# EAGLE design main (EAGLE 7.7.0)
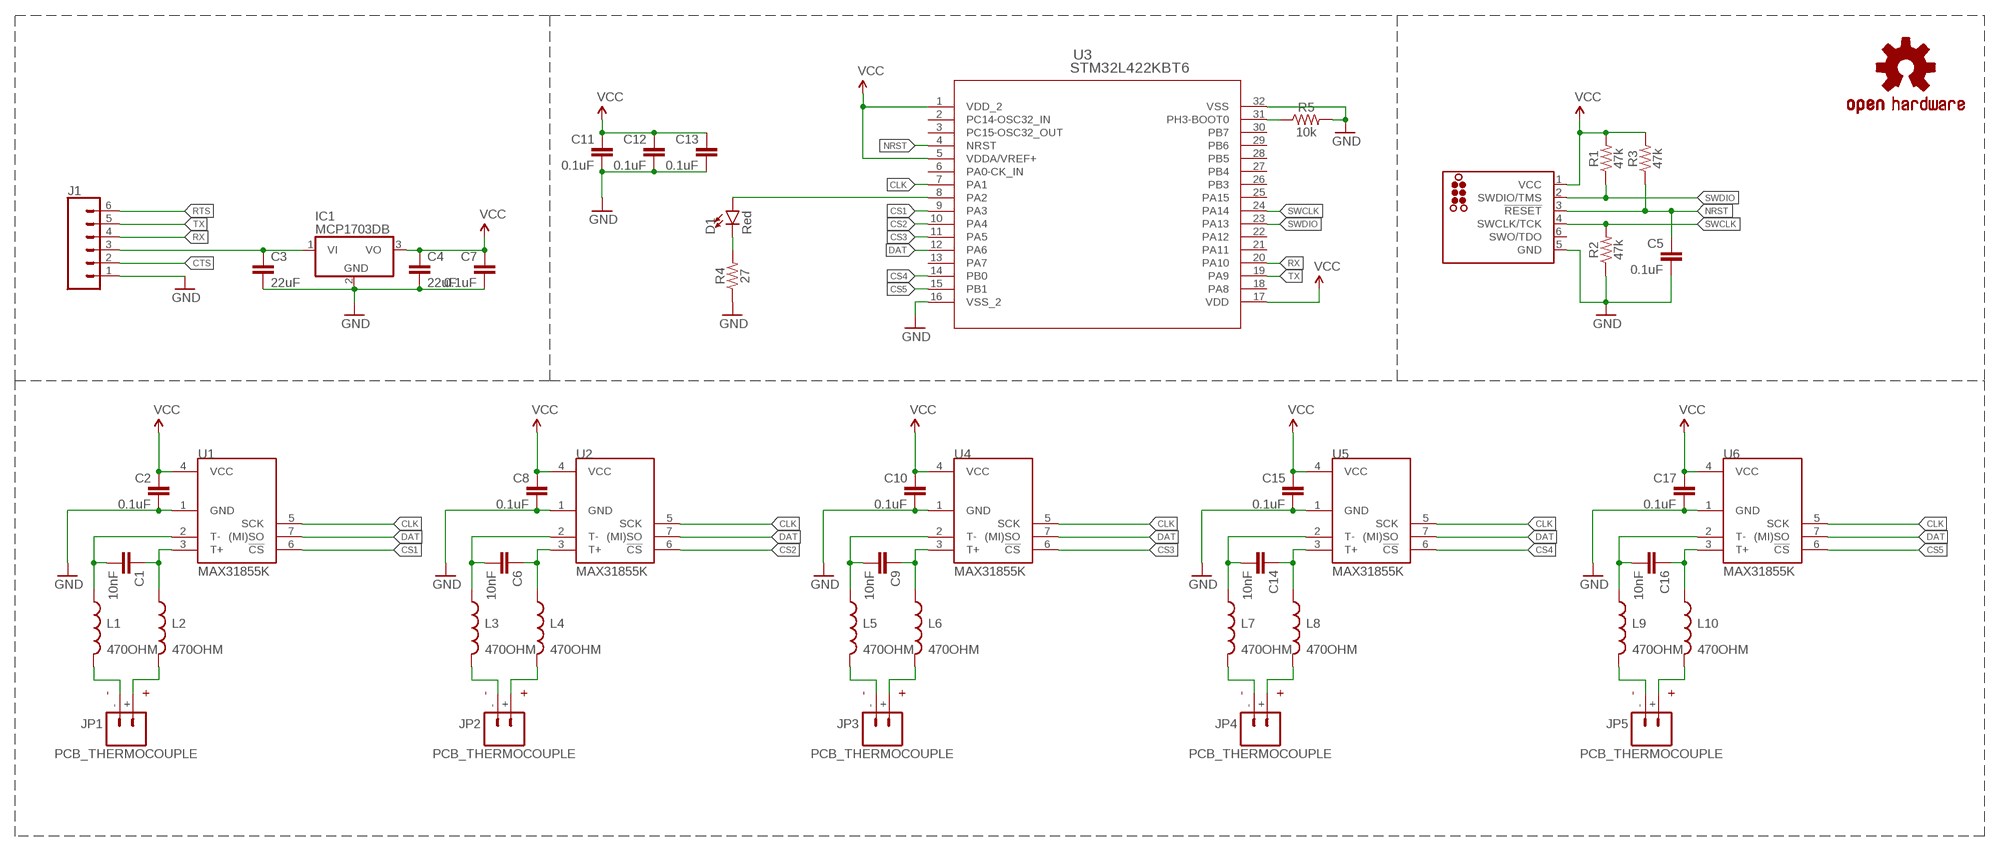
[diagram p0: schematic, sheet 1]

## Parts
C1  10nF  10NF/10000PF-50V-10%(0603)  [0603-CAP]
C2  0.1uF  0.1UF-25V(+80/-20%)(0603)  [0603-CAP]
C3  22uF  22UF-0603-6.3V-20%  [0603]
C4  22uF  22UF-0603-6.3V-20%  [0603]
C5  0.1uF  0.1UF-25V(+80/-20%)(0603)  [0603-CAP]
C6  10nF  10NF/10000PF-50V-10%(0603)  [0603-CAP]
C7  0.1uF  0.1UF-25V(+80/-20%)(0603)  [0603-CAP]
C8  0.1uF  0.1UF-25V(+80/-20%)(0603)  [0603-CAP]
C9  10nF  10NF/10000PF-50V-10%(0603)  [0603-CAP]
C10  0.1uF  0.1UF-25V(+80/-20%)(0603)  [0603-CAP]
C11  0.1uF  0.1UF-25V(+80/-20%)(0603)  [0603-CAP]
C12  0.1uF  0.1UF-25V(+80/-20%)(0603)  [0603-CAP]
C13  0.1uF  0.1UF-25V(+80/-20%)(0603)  [0603-CAP]
C14  10nF  10NF/10000PF-50V-10%(0603)  [0603-CAP]
C15  0.1uF  0.1UF-25V(+80/-20%)(0603)  [0603-CAP]
C16  10nF  10NF/10000PF-50V-10%(0603)  [0603-CAP]
C17  0.1uF  0.1UF-25V(+80/-20%)(0603)  [0603-CAP]
D1  Red  LED-RED-0603-WE  [LED-0603]
IC1  MCP1703DB  [SOT223]
J1  CONN_06NO_SILK_NO_POP  [1X06_NO_SILK]
J2  TC2030_SWD-MCP-NL  [TC2030-MCP-NL]
JP1  PCB_THERMOCOUPLE  [PCC-SMP]
JP2  PCB_THERMOCOUPLE  [PCC-SMP]
JP3  PCB_THERMOCOUPLE  [PCC-SMP]
JP4  PCB_THERMOCOUPLE  [PCC-SMP]
JP5  PCB_THERMOCOUPLE  [PCC-SMP]
L1  470OHM  INDUCTOR0603  [0603]
L2  470OHM  INDUCTOR0603  [0603]
L3  470OHM  INDUCTOR0603  [0603]
L4  470OHM  INDUCTOR0603  [0603]
L5  470OHM  INDUCTOR0603  [0603]
L6  470OHM  INDUCTOR0603  [0603]
L7  470OHM  INDUCTOR0603  [0603]
L8  470OHM  INDUCTOR0603  [0603]
L9  470OHM  INDUCTOR0603  [0603]
L10  470OHM  INDUCTOR0603  [0603]
LOGO1  OSHW-LOGOL  [OSHW-LOGO-L]
R1  47k  47KOHM-0603-1/10W-1%  [0603]
R2  47k  47KOHM-0603-1/10W-1%  [0603]
R3  47k  47KOHM-0603-1/10W-1%  [0603]
R4  27  27OHM-0603-1/10W-1%  [0603]
R5  10k  10KOHM-0603-1/10W-1%  [0603]
U1  MAX31855K  [SOIC8]
U2  MAX31855K  [SOIC8]
U3  STM32L422KBT6  [LQFP_422KBT6_STM]
U4  MAX31855K  [SOIC8]
U5  MAX31855K  [SOIC8]
U6  MAX31855K  [SOIC8]

## Nets
+5V: C3.1 IC1.1(VI) J1.3
CLK: U1.5(SCK) U2.5(SCK) U3.7(PA1) U4.5(SCK) U5.5(SCK) U6.5(SCK)
CS1: U1.6(!CS) U3.9(PA3)
CS2: U2.6(!CS) U3.10(PA4)
CS3: U3.11(PA5) U4.6(!CS)
CS4: U3.14(PB0) U5.6(!CS)
CS5: U3.15(PB1) U6.6(!CS)
CTS: J1.2
DAT: U1.7((MI)SO) U2.7((MI)SO) U3.12(PA6) U4.7((MI)SO) U5.7((MI)SO) U6.7((MI)SO)
GND: C2.2 C3.2 C4.2 C5.2 C7.2 C8.2 C10.2 C11.2 C12.2 C13.2 C15.2 C17.2 IC1.2(GND) J1.1 J2.5(GND) R2.1 R4.1 R5.2 U1.1(GND) U2.1(GND) U3.16(VSS_2) U3.32(VSS) U4.1(GND) U5.1(GND) U6.1(GND)
N$1: C6.1 L4.1 U2.3(T+)
N$2: C6.2 L3.1 U2.2(T-)
N$3: JP2.- L3.2
N$4: JP2.+ L4.2
N$5: C1.2 L1.1 U1.2(T-)
N$6: JP1.- L1.2
N$7: C1.1 L2.1 U1.3(T+)
N$8: C9.1 L6.1 U4.3(T+)
N$9: JP1.+ L2.2
N$10: C9.2 L5.1 U4.2(T-)
N$11: JP3.- L5.2
N$12: JP3.+ L6.2
N$13: C14.1 L8.1 U5.3(T+)
N$14: C14.2 L7.1 U5.2(T-)
N$15: JP4.- L7.2
N$16: JP4.+ L8.2
N$17: C16.1 L10.1 U6.3(T+)
N$18: C16.2 L9.1 U6.2(T-)
N$19: JP5.- L9.2
N$20: JP5.+ L10.2
N$21: D1.A U3.8(PA2)
N$22: D1.C R4.2
N$23: R5.1 U3.31(PH3-BOOT0)
NRST: C5.1 J2.3(!RESET) R3.1 U3.4(NRST)
RTS: J1.6
RX: J1.4 U3.20(PA10)
SWCLK: J2.4(SWCLK/TCK) R2.2 U3.24(PA14)
SWDIO: J2.2(SWDIO/TMS) R1.1 U3.23(PA13)
TX: J1.5 U3.19(PA9)
VCC: C2.1 C4.1 C7.1 C8.1 C10.1 C11.1 C12.1 C13.1 C15.1 C17.1 IC1.3(VO) J2.1(VCC) R1.2 R3.2 U1.4(VCC) U2.4(VCC) U3.1(VDD_2) U3.5(VDDA/VREF+) U3.17(VDD) U4.4(VCC) U5.4(VCC) U6.4(VCC)
Unconnected: J2.6(SWO/TDO) JP1.CLIP1 JP1.CLIP2 JP2.CLIP1 JP2.CLIP2 JP3.CLIP1 JP3.CLIP2 JP4.CLIP1 JP4.CLIP2 JP5.CLIP1 JP5.CLIP2 U3.2(PC14-OSC32_IN) U3.3(PC15-OSC32_OUT) U3.6(PA0-CK_IN) U3.13(PA7) U3.18(PA8) U3.21(PA11) U3.22(PA12) U3.25(PA15) U3.26(PB3) U3.27(PB4) U3.28(PB5) U3.29(PB6) U3.30(PB7)

## Library data of the parts
C1 C6 C9 C14 C16 = SparkFun-Capacitors:10NF/10000PF-50V-10%(0603): CAP-00867; PROD_ID: CAP-00867
C2 C5 C7 C8 C10-C13 C15 C17 = SparkFun-Capacitors:0.1UF-25V(+80/-20%)(0603): CAP-00810 Ceramic Standard decoupling cap; PROD_ID: CAP-00810
C3 C4 = SparkFun-Capacitors:22UF: 22µF ceramic capacitors A capacitor is a passive two-terminal electrical component used to store electrical energy temporarily in an electric field.; PROD_ID: CAP-14464
D1 = SparkFun-LED:LED-RED: Red SMD LED Used in manufacturing of most products at SparkFun Packages: 0603 - SMD 0603 package [Product Link] <http://docs.avagotech.com/docs/AV02-0551EN> 0603 SMART - SMD 0603 SMART package ( more efficient and expensive)[Product Link] <http://www.osram-os.com/Graphics/XPic2/00077099_0.pdf> 1206 - SMD1206 package [Product Link] <https://www.sparkfun.com/datasheets/DevTools/LilyPad/Q150OVS4.pdff> SparkFun Products: Pro Mini 328 -5V <https://www.sparkfun.com/products/821> RedBoard <https://www.sparkfun.com/products/12757> IOIO-OTG <https://www.sparkfun.com/products/13613>; PROD_ID: DIO-16511
IC1 = linear:MCP1703: 250 mA, 16V, Low Quiescent Current LDO Regulator Source: http://ww1.microchip.com/downloads/en/DeviceDoc/22049b.pdf
J1 = SparkFun-Connectors:CONN_06: Multi connection point. Often used as Generic Header-pin footprint for 0.1 inch spaced/style header connections On any of the 0.1 inch spaced packages, you can populate with these: Break Away Headers - Straight <https://www.sparkfun.com/products/116> (PRT-00116) Break Away Male Headers - Right Angle <https://www.sparkfun.com/products/553> (PRT-00553) Female Headers <https://www.sparkfun.com/products/115> (PRT-00115) Break Away Headers - Machine Pin <https://www.sparkfun.com/products/117> (PRT-00117) Break Away Female Headers - Swiss Machine Pin <https://www.sparkfun.com/products/743> (PRT-00743) Arduino Stackable Header - 6 Pin <https://www.sparkfun.com/products/9280> (PRT-09280) Screw Terminals 2.54mm Pitch (6-Pin) <https://www.sparkfun.com/products/16499> (PRT-16499) For SCREWTERMINALS and SPRING TERMINALS visit here: Screw Terimnals on SparkFun.com <https://www.sparkfun.com/search/results?term=Screw+Terminals> (5mm/3.5mm/2.54mm spacing) This device is also useful as a general connection point to wire up your design to another part of your project. Our various solder wires solder well into these plated through hole pads. Hook-Up Wire - Assortment (Stranded, 22 AWG) <https://www.sparkfun.com/products/11375> (PRT-11375) Hook-Up Wire - Assortment (Solid Core, 22 AWG) <https://www.sparkfun.com/products/11367> (PRT-11367) View the entire wire category on our website here <https://www.sparkfun.com/categories/141>
J2 = tag-connect:TC2030_SWD: ARM20-CTX 20-Pin to TC2030-IDC Adapter for Cortex 6-Pin (TC2030-IDC family) </catalog/6> Cortex SWD </catalog/9> Adapters </adaptors> <javascript:void(0);> The Tag-Connect ARM20-CTX adapter board allows our TC2030-IDC cables to be used for ARM SWD (Single Wire Debug) applications. Although intended for use with our patented TC2030-IDC (and TC2030-IDC-NL) Plug-of-Nails™ Cables, the adapter may be useful to people wishing to use 6-pin 0.1” ribbon headers on their PCB instead of the traditional 20-Pin header. Please note the TC2030-IDC <http://tag-connect.com/TC2030-IDC> or TC2030-IDC-NL <http://tag-connect.com/TC2030-IDC-NL> cable is purchased separately, the cables and Segger JLINK seen in the pictures are not included! Download the Datasheet here. <http://www.tag-connect.com/Materials/ARM20-CTX.pdf>
JP1-JP5 = Testing:PCB_THERMOCOUPLE: Circuit Board Thermocouple Connectors Glass-Filled Nylon 220°C (425°F) The PCC connector from OMEGA is perfect for bringing thermocouple probes to printed circuit boards. (OMEGA PCC-SMP) For type-k thermocouples.
L1-L10 = SparkFun-Passives:INDUCTOR: Inductors Basic Inductor/Choke - 0603 and 1206. Footprints are not proven and vary greatly between part numbers. INDUCTOR POWER 3.3UH 4.0A SMD 0.197" L x 0.197" W x 0.177" H (5.00mm x 5.00mm x 4.50mm); PROD_ID: NDUC-12579
LOGO1 = SparkFun-Aesthetics:OSHW-LOGO: Open-Source Hardware (OSHW) Logo This logo indicates the piece of hardware it is found on incorporates a OSHW license and/or adheres to the definition of open source hardware found here: http://freedomdefined.org/OSHW
R1-R3 = SparkFun-Resistors:47KOHM: 47kΩ resistor A resistor is a passive two-terminal electrical component that implements electrical resistance as a circuit element. Resistors act to reduce current flow, and, at the same time, act to lower voltage levels within circuits. - Wikipedia; PROD_ID: RES-07871
R4 = SparkFun-Resistors:27OHM: 27Ω resistor A resistor is a passive two-terminal electrical component that implements electrical resistance as a circuit element. Resistors act to reduce current flow, and, at the same time, act to lower voltage levels within circuits. - Wikipedia; PROD_ID: RES-09334
R5 = SparkFun-Resistors:10KOHM: 10kΩ resistor A resistor is a passive two-terminal electrical component that implements electrical resistance as a circuit element. Resistors act to reduce current flow, and, at the same time, act to lower voltage levels within circuits. - Wikipedia; PROD_ID: RES-00824
U1 U2 U4-U6 = SparkFun-AnalogIC:MAX31855K: Cold-Junction-Compensated K-Thermocoupleto-Digital Converter (-270°C to +1800°C) The MAX31855K performs cold-junction compensation and digitizes the signal from a type-K thermocouple. The data is output in a 14-bit resolution, SPI™-compatible, read-only format. This converter resolves temperatures to 0.25°C, allows readings as high as +1800°C and as low as -270°C, and exhibits thermocouple accuracy of ±2°C for temperatures ranging from -200°C to +700°C for K-type thermocouples.; PROD_ID: IC-12578
U3 = stm32xx:STM32L422KBT6; COPYRIGHT: Copyright (C) 2023 Ultra Librarian. All rights reserved.; MANUFACTURER_PART_NUMBER: STM32L422KBT6; MFR_NAME: STMicroelectronics

## Board
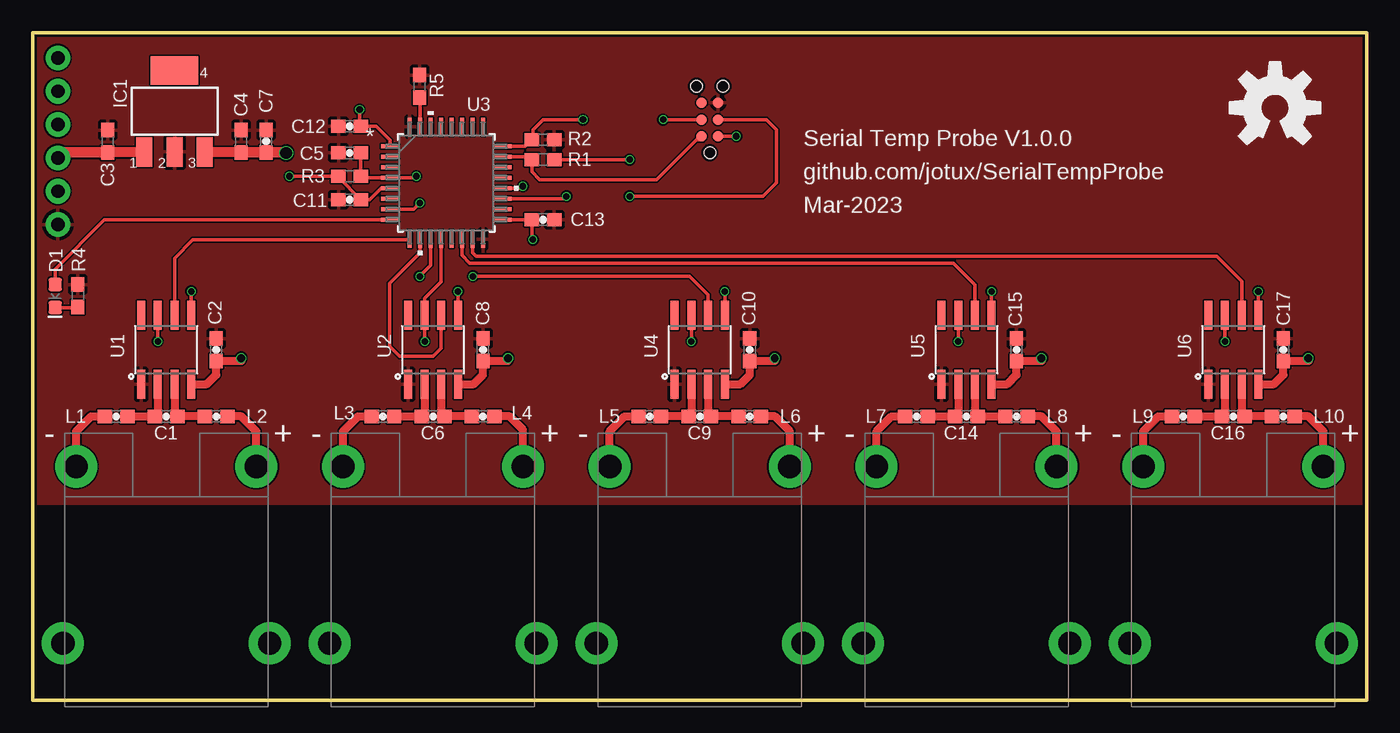
[diagram p1: board, top side]
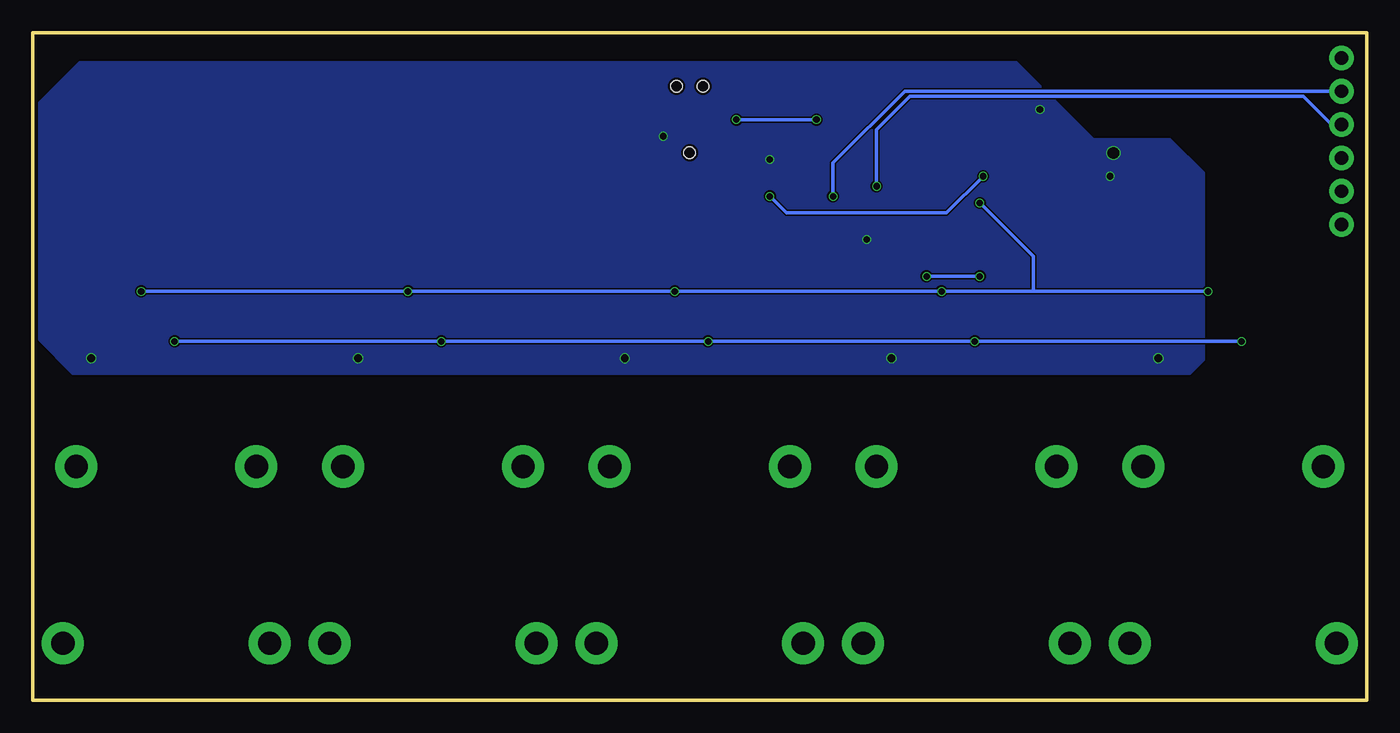
[diagram p2: board, bottom side, seen from below]

Size 101.6 x 50.8 mm. Coordinates in mm from the lower left corner, seen from the top.
Outline: 0,0 101.6,0 101.6,50.8 0,50.8 0,0
Copper layers (1*16): Top 0.035mm / dielectric 1.6mm / Bottom 0.035mm
Design rules "jlcpcb-2layers": minimum track width 5mil, minimum drill 0.3mm, track to track 5mil, track to pad 5mil, pad to pad 5mil, via to via 5mil, smd to smd 5mil, copper to edge 0.2mm, drill to drill 6mil, minimum pad ring 10mil, minimum via ring 3mil, stop-mask expansion 4mil, vias tented up to drill 0mil, thermal gap 10mil

### Footprints (pad centres in the part's own frame; a part is rotated, then mirrored left to right if it is on the bottom)
0603-CAP = smd 1.1 x 1: 1 -0.85,0; 2 0.85,0
0603 = smd 1.1 x 1: 1 -0.85,0; 2 0.85,0
LED-0603 = smd 1 x 1: A -0.877,0; C 0.877,0
SOT223 = smd 1.219 x 2.235: 1 -2.311,-3.099; 2 0,-3.099; 3 2.311,-3.099 | smd 3.6 x 2.2: 4 0,3.099
1X06_NO_SILK = drill 1.016 pad 1.88: 1 0,0; 2 2.54,0; 3 5.08,0; 4 7.62,0; 5 10.16,0; 6 12.7,0
TC2030-MCP-NL = smd 0.787 x 0.787: 1 1.27,-0.635; 2 1.27,0.635; 3 2.54,-0.635; 4 2.54,0.635; 5 3.81,-0.635; 6 3.81,0.635 | hole 0.889: 0,0; 5.08,-1.016; 5.08,1.016
PCC-SMP = drill 1.778: + 6.858,0; - -6.858,0; CLIP1 -7.874,-13.462; CLIP2 7.874,-13.462
SOIC8 = smd 0.61 x 2.21: 1 -1.905,-2.616; 2 -0.635,-2.616; 3 0.635,-2.616; 4 1.905,-2.616; 5 1.905,2.616; 6 0.635,2.616; 7 -0.635,2.616; 8 -1.905,2.616
LQFP_422KBT6_STM = smd 1.359 x 0.305: 1 -4.274,2.8; 2 -4.274,2; 3 -4.274,1.2; 4 -4.274,0.4; 5 -4.274,-0.4; 6 -4.274,-1.2; 7 -4.274,-2; 8 -4.274,-2.8; 17 4.274,-2.8; 18 4.274,-2; 19 4.274,-1.2; 20 4.274,-0.4; 21 4.274,0.4; 22 4.274,1.2; 23 4.274,2; 24 4.274,2.8 | smd 0.305 x 1.359: 9 -2.8,-4.274; 10 -2,-4.274; 11 -1.2,-4.274; 12 -0.4,-4.274; 13 0.4,-4.274; 14 1.2,-4.274; 15 2,-4.274; 16 2.8,-4.274; 25 2.8,4.274; 26 2,4.274; 27 1.2,4.274; 28 0.4,4.274; 29 -0.4,4.274; 30 -1.2,4.274; 31 -2,4.274; 32 -2.8,4.274

### Placement (x,y rotation side)
C1  10.16,21.59 180 top
C2  13.97,26.67 90 top
C3  5.71,42.55 90 top
C4  15.88,42.55 90 top
C5  24.13,41.66 180 top
C6  30.48,21.59 180 top
C7  17.78,42.55 90 top
C8  34.29,26.67 90 top
C9  50.8,21.59 180 top
C10  54.61,26.67 90 top
C11  24.13,38.1 180 top
C12  24.13,43.69 180 top
C13  38.86,36.58 0 top
C14  71.12,21.59 180 top
C15  74.93,26.67 90 top
C16  91.44,21.59 180 top
C17  95.25,26.67 90 top
D1  1.7,30.76 270 top
IC1  10.79,44.83 0 top
J1  1.91,36.2 90 top
J2  51.56,41.66 90 top
JP1  10.16,17.78 0 top
JP2  30.48,17.78 0 top
JP3  50.8,17.78 0 top
JP4  71.12,17.78 0 top
JP5  91.44,17.78 0 top
L1  6.35,21.59 180 top
L2  13.97,21.59 0 top
L3  26.67,21.59 180 top
L4  34.29,21.59 0 top
L5  46.99,21.59 180 top
L6  54.61,21.59 0 top
L7  67.31,21.59 180 top
L8  74.93,21.59 0 top
L9  87.63,21.59 180 top
L10  95.25,21.59 0 top
LOGO1  94.61,45.09 0 top
R1  38.86,41.15 0 top
R2  38.86,42.67 180 top
R3  24.13,39.88 180 top
R4  3.43,30.78 270 top
R5  29.46,46.74 90 top
U1  10.16,26.67 0 top
U2  30.48,26.67 0 top
U3  31.5,39.37 0 top
U4  50.8,26.67 0 top
U5  71.12,26.67 0 top
U6  91.44,26.67 0 top

### Tracks (layer width: path | path; a pad name or v marks a point on that pad's centre or on a via)
+5V
  Top 0.813: J1.3 2.33,41.7 C3.1 IC1.1
CLK  (via drill 0.5)
  Top 0.254: U6.5 v93.34,31.11 | v73.03,31.11 U5.5 | U1.5 v12.06,31.11 | v32.38,31.11 U2.5 | U4.5 v52.7,31.11 | U3.7 28.99,37.37 v29.46,37.85
  Bottom 0.254: v93.34,31.11 v73.03,31.11 v52.7,31.11 v32.38,31.11 25.4,31.11 | v12.06,31.11 25.4,31.11 | v29.46,37.85 25.4,33.78 25.4,31.11
CS1
  Top 0.254: U1.6 10.79,33.66 12.19,35.05 28.65,35.05 U3.9
CS2
  Top 0.254: U2.6 31.11,26.8 30.48,26.16 27.94,26.16 27.18,26.92 27.18,31.75 29.5,34.07 U3.10 29.46,35.06
CS3  (via drill 0.5)
  Top 0.254: v33.53,32.26 50.04,32.26 51.44,30.86 U4.6 | U3.11 30.3,33.09 v29.46,32.26
  Bottom 0.254: v29.46,32.26 v33.53,32.26
CS4
  Top 0.254: U3.14 32.7,33.85 33.27,33.27 70.1,33.27 71.75,31.62 U5.6
CS5
  Top 0.254: U3.15 33.5,34.07 33.78,33.78 90.17,33.78 92.08,31.88 U6.6
DAT  (via drill 0.5)
  Top 0.254: U1.7 v9.53,27.3 | v29.84,27.3 U2.7 29.84,30.61 31.1,31.86 U3.12 | U4.7 v50.16,27.3 | U5.7 v70.48,27.3 | U6.7 v90.81,27.3
  Bottom 0.254: v9.53,27.3 v29.84,27.3 v50.16,27.3 v70.48,27.3 v90.81,27.3
GND
  pour Top: 0.25,50.55 101.35,50.55 101.35,14.99 0.25,14.99
N$1
  Top 0.61: U2.3 31.11,21.8 C6.1 L4.1
N$2
  Top 0.61: L3.1 C6.2 29.84,21.8 U2.2
N$3
  Top 0.61: JP2.- 23.62,20.45 24.77,21.59 L3.2
N$4
  Top 0.61: JP2.+ 37.34,20.57 36.32,21.59 L4.2
N$5
  Top 0.61: L1.1 C1.2 9.53,21.8 U1.2
N$6
  Top 0.61: JP1.- 3.3,20.45 4.45,21.59 L1.2
N$7
  Top 0.61: L2.1 C1.1 10.79,21.8 U1.3
N$8
  Top 0.61: L6.1 C9.1 51.44,21.8 U4.3
N$9
  Top 0.61: JP1.+ 17.02,20.45 15.88,21.59 L2.2
N$10
  Top 0.61: U4.2 50.16,21.8 C9.2 L5.1
N$11
  Top 0.61: JP3.- 43.94,20.45 45.09,21.59 L5.2
N$12
  Top 0.61: JP3.+ 57.66,20.45 56.52,21.59 L6.2
N$13
  Top 0.61: U5.3 71.75,21.8 C14.1 L8.1
N$14
  Top 0.61: L7.1 C14.2 70.48,21.8 U5.2
N$15
  Top 0.61: JP4.- 64.26,20.45 65.41,21.59 L7.2
N$16
  Top 0.61: JP4.+ 77.98,20.45 76.83,21.59 L8.2
N$17
  Top 0.61: U6.3 92.08,21.8 C16.1 L10.1
N$18
  Top 0.61: L9.1 C16.2 90.81,21.8 U6.2
N$19
  Top 0.61: JP5.- 84.58,20.45 85.72,21.59 L9.2
N$20
  Top 0.61: JP5.+ 98.3,20.45 97.16,21.59 L10.2
N$21
  Top 0.254: D1.A 1.7,32.82 5.46,36.57 U3.8
N$22
  Top 0.254: D1.C 3.38,29.88 R4.2
N$23
  Top 0.254: U3.31 29.5,45.85 R5.1
NRST  (via drill 0.5)
  Top 0.254: C5.1 R3.1 25.09,39.77 U3.4 29.1,39.77 v29.21,39.88 | v45.47,38.35 55.63,38.35 56.64,39.37 56.64,43.43 55.88,44.2 J2.3
  Bottom 0.254: v45.47,38.35 44.2,37.08 32,37.08 v29.21,39.88
RX  (via drill 0.5)
  Top 0.254: v37.34,39.12 37.19,38.97 U3.20
  Bottom 0.254: J1.4 2.67,43.81 4.83,45.97 34.8,45.97 37.34,43.43 v37.34,39.12
SWCLK  (via drill 0.5)
  Top 0.254: U3.24 37.51,42.17 R2.2 38.1,42.67 38.1,43.43 38.86,44.2 v41.91,44.2 | v48.01,44.2 J2.4
  Bottom 0.254: v41.91,44.2 v48.01,44.2
SWDIO
  Top 0.254: U3.23 37.79,41.37 R1.1 | 38.1,41.15 R1.1 | J2.2 51.05,42.93 51.05,42.67 50.55,42.67 47.5,39.62 38.61,39.62 38.01,40.22 R1.1
TX  (via drill 0.5)
  Top 0.254: v40.64,38.35 40.46,38.17 U3.19
  Bottom 0.254: J1.5 35.18,46.35 40.64,40.89 v40.64,38.35
VCC  (via drill 0.5, 0.6, 0.9)
  Top 0.254: U3.5 26.52,38.97 25.65,38.1 C11.1 23.28,39.8 R3.2 v19.56,39.88 | U3.1 27.22,42.63 26.16,43.69 C12.1 24.89,43.78 v24.89,44.96 | U3.17 C13.1 38.01,35.14 v38.1,35.05 | J2.1 v53.59,42.93 | R1.2 v45.47,41.15
  Top 0.61: U2.4 33.58,24.05 34.29,24.77 C8.1 36.2,25.82 v36.2,26.04 | U4.4 53.9,24.05 54.61,24.77 C10.1 56.52,25.82 v56.52,26.04 | U5.4 74.22,24.05 74.93,24.77 C15.1 76.83,25.82 v76.83,26.04 | U6.4 94.54,24.05 95.25,24.77 C17.1 97.16,25.82 v97.16,26.04 | U1.4 13.26,24.05 13.97,24.77 C2.1 15.88,25.82 v15.88,26.04
  Top 0.813: v19.3,41.66 19.3,41.7 C7.1 C4.1 IC1.3
  pour Bottom: 14.99,42.67 20.83,42.67 26.67,48.51 98.04,48.51 101.09,45.47 101.09,27.43 98.55,24.89 13.46,24.89 12.45,25.91 12.45,40.13

### Text on the board
tPlace: Serial Temp Probe V1.0.0 | github.com/jotux/SerialTempProbe | Mar-2023